# EasyEDA Pro project ProProject_2024电赛备赛清单_Wang01_2024-08-05.epro, board PCB6
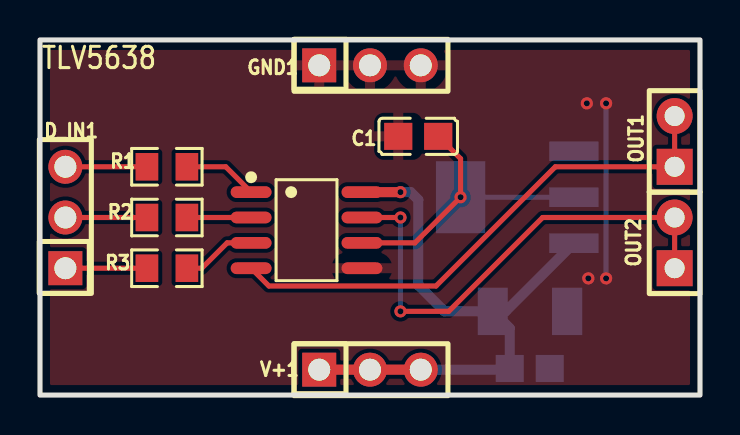
[diagram p12: board, top side]
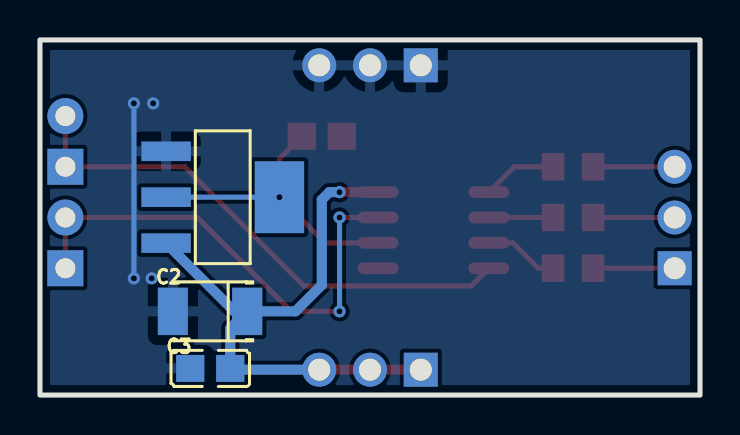
[diagram p13: board, bottom side, seen from below]

Outline 33.02 x 17.78 mm; copper layers: Top Layer, Bottom Layer. Coordinates in mm from the lower left corner of the outline.
Outline path: rectangle 0,17.78 33.02,0
Stack: Top Layer 0.035mm / Dielectric1 1.51mm FR4 er 4.5 / Bottom Layer 0.035mm

## Design rules (mm)
template: JLCPCB Capability(Two Layers Board)
spacing copperThickness1oz (default): track to track 0.102, other pairs 0.152 to 0.3
spacing copperThickness2oz: track to track 0.203, other pairs 0.152 to 0.3
track width copperThickness1oz (default): min 0.127, default 0.254, max 2.54
track width copperThickness2oz: min 0.203, default 0.254, max 2.54
differential pair differentialPair (default): width min 0.127, default 0.254, max 2.54; gap min 0.152, default 0.152
via viaSize (default): diameter min 0.5, default 0.61, max 10; hole min 0.3, default 0.305, max 6.3

## Placement (name value [footprint] x y rotation side)
C1  1uF  [C0805]  18.92 12.95 180 top
C2  100uF  [CASE-B_3528]  24.51 4.19 0 bottom
C3  1uF  [C0805]  24.5 1.33 0 bottom
D_IN1  TXM_3  [HDR-TH_3P-P2.54-V-M-A]  1.27 8.89 90 top
GND1  TXM_3  [HDR-TH_3P-P2.54-V-M-A]  16.51 16.51 0 top
OUT1  HDR1X2  [HDR-TH_2P-P2.54-V-M-1]  31.75 12.7 90 top
OUT2  HDR1X2  [HDR-TH_2P-P2.54-V-M-1]  31.75 7.62 90 top
R1  1MΩ  [R0805]  6.35 11.43 0 top
R2  1MΩ  [R0805]  6.35 8.89 0 top
R3  1MΩ  [R0805]  6.35 6.35 0 top
U1  TLV5638QD  [SOIC-8_L4.9-W3.9-P1.27-LS6.0-BL]  13.33 8.25 270 top
U4  LM1117MPX-5.0/NOPB  [SOT-223-4_L6.5-W3.5-P2.30-LS7.0-BR]  23.88 9.91 0 bottom
U11  -  [丝印logo_UMR]  10.03 8.76 180 bottom
V+1  TXM_3  [HDR-TH_3P-P2.54-V-M-A]  16.51 1.27 0 top

## Footprints (pads in the part's own frame, mm; a bottom-side part is the same pattern mirrored in y, then rotated)
C0805
  rect 1.41x1.35 smd: 1(-1,0) 2(1,0)
CASE-B_3528
  rect 1.506x2.376 smd: 1(-1.861,0) 2(1.861,0)
HDR-TH_2P-P2.54-V-M-1
  rect 1.8x1.8 hole 1: 1(-1.27,0)
  round 1.8 hole 1: 2(1.27,0)
HDR-TH_3P-P2.54-V-M-A
  rect 1.7x1.7 hole 1.1: 1(-2.54,0)
  round 1.7 hole 1.1: 2(0,0) 3(2.54,0)
R0805
  rect 1.133x1.377 smd: 1(-1,0) 2(1,0)
SOIC-8_L4.9-W3.9-P1.27-LS6.0-BL
  oval 0.588x2.045 smd: 1(-1.905,-2.772) 2(-0.635,-2.772) 3(0.635,-2.772) 4(1.905,-2.772) 5(1.905,2.772) 6(0.635,2.772) 7(-0.635,2.772) 8(-1.905,2.772)
SOT-223-4_L6.5-W3.5-P2.30-LS7.0-BR
  rect 2.47x0.98 smd: 1(2.835,-2.3) 2(2.835,0) 3(2.835,2.3)
  rect 2.47x3.6 smd: 4(-2.835,0)

## Nets
As in the schematic.

## Via types
v1: diameter 0.61, hole 0.305, Top Layer to Bottom Layer, 8 vias

## Routing (per net, layer and track width the routed paths; a pad name or vN(x,y) marks a point on that pad's centre or on a via; arc(x,y) is an arc through that point)
GND: length 8.8
  Bottom Layer w0.254: v1(28.32,14.61) v1(28.32,5.84)
  vias: v1(27.36,14.61) v1(27.43,5.84)
VCC: length 29.8
  Top Layer w0.508: v1(18.03,10.16) U1.8 ; V+1.1 V+1.2 V+1.3
  Bottom Layer w0.508: 26.71,7.61 23.3,4.19 C2.1 ; C2.1 23.5,3.34 C3.1 23.44,1.27 V+1.3 ; C2.1 20.24,4.19 18.92,5.51 18.92,9.78 18.54,10.16 v1(18.03,10.16)
OUT1: length 26.6
  Top Layer w0.254: OUT1.2 OUT1.1 25.78,11.43 19.81,5.46 11.45,5.46 U1.4
OUT2: length 24.8
  Top Layer w0.254: U1.7 v1(18.03,8.89) ; v1(18.03,4.19) 20.45,4.19 25.15,8.89 OUT2.2 OUT2.1
  Bottom Layer w0.254: v1(18.03,4.19) v1(18.03,8.89)
VREF: length 15.1
  Top Layer w0.254: C1.1 21.04,11.84 v1(21.04,9.91) 18.75,7.62 U1.6
  Bottom Layer w0.254: v1(21.04,9.91) 26.71,9.91
$1N885: length 4.1
  Top Layer w0.254: D_IN1.2 R2.1
$1N888: length 4.1
  Top Layer w0.254: D_IN1.3 R1.1
$1N892: length 4.1
  Top Layer w0.254: D_IN1.1 R3.1
$1N896: length 3.7
  Top Layer w0.254: U1.3 9.36,7.62 8.09,6.35 R3.2
$1N901: length 3.2
  Top Layer w0.254: R2.2 U1.2
$1N904: length 3.7
  Top Layer w0.254: R1.2 9.29,11.43 U1.1

## Copper pours and planes (outline as drawn; the poured copper is in the pictures)
GND on Top Layer: 0,17.78 33.02,17.78 33.02,0 0,0
GND on Top Layer: 12.11,17.78 33.02,17.78 33.02,0 12.11,0
GND on Bottom Layer: 12.09,17.78 33.02,17.78 33.02,0 12.09,0
GND on Bottom Layer: 0,17.78 33.02,17.78 33.02,0 0,0

## Text on the board
Top Silkscreen Layer: TLV5638
